# EAGLE design relay-board-adapter (EAGLE 9.2.2)
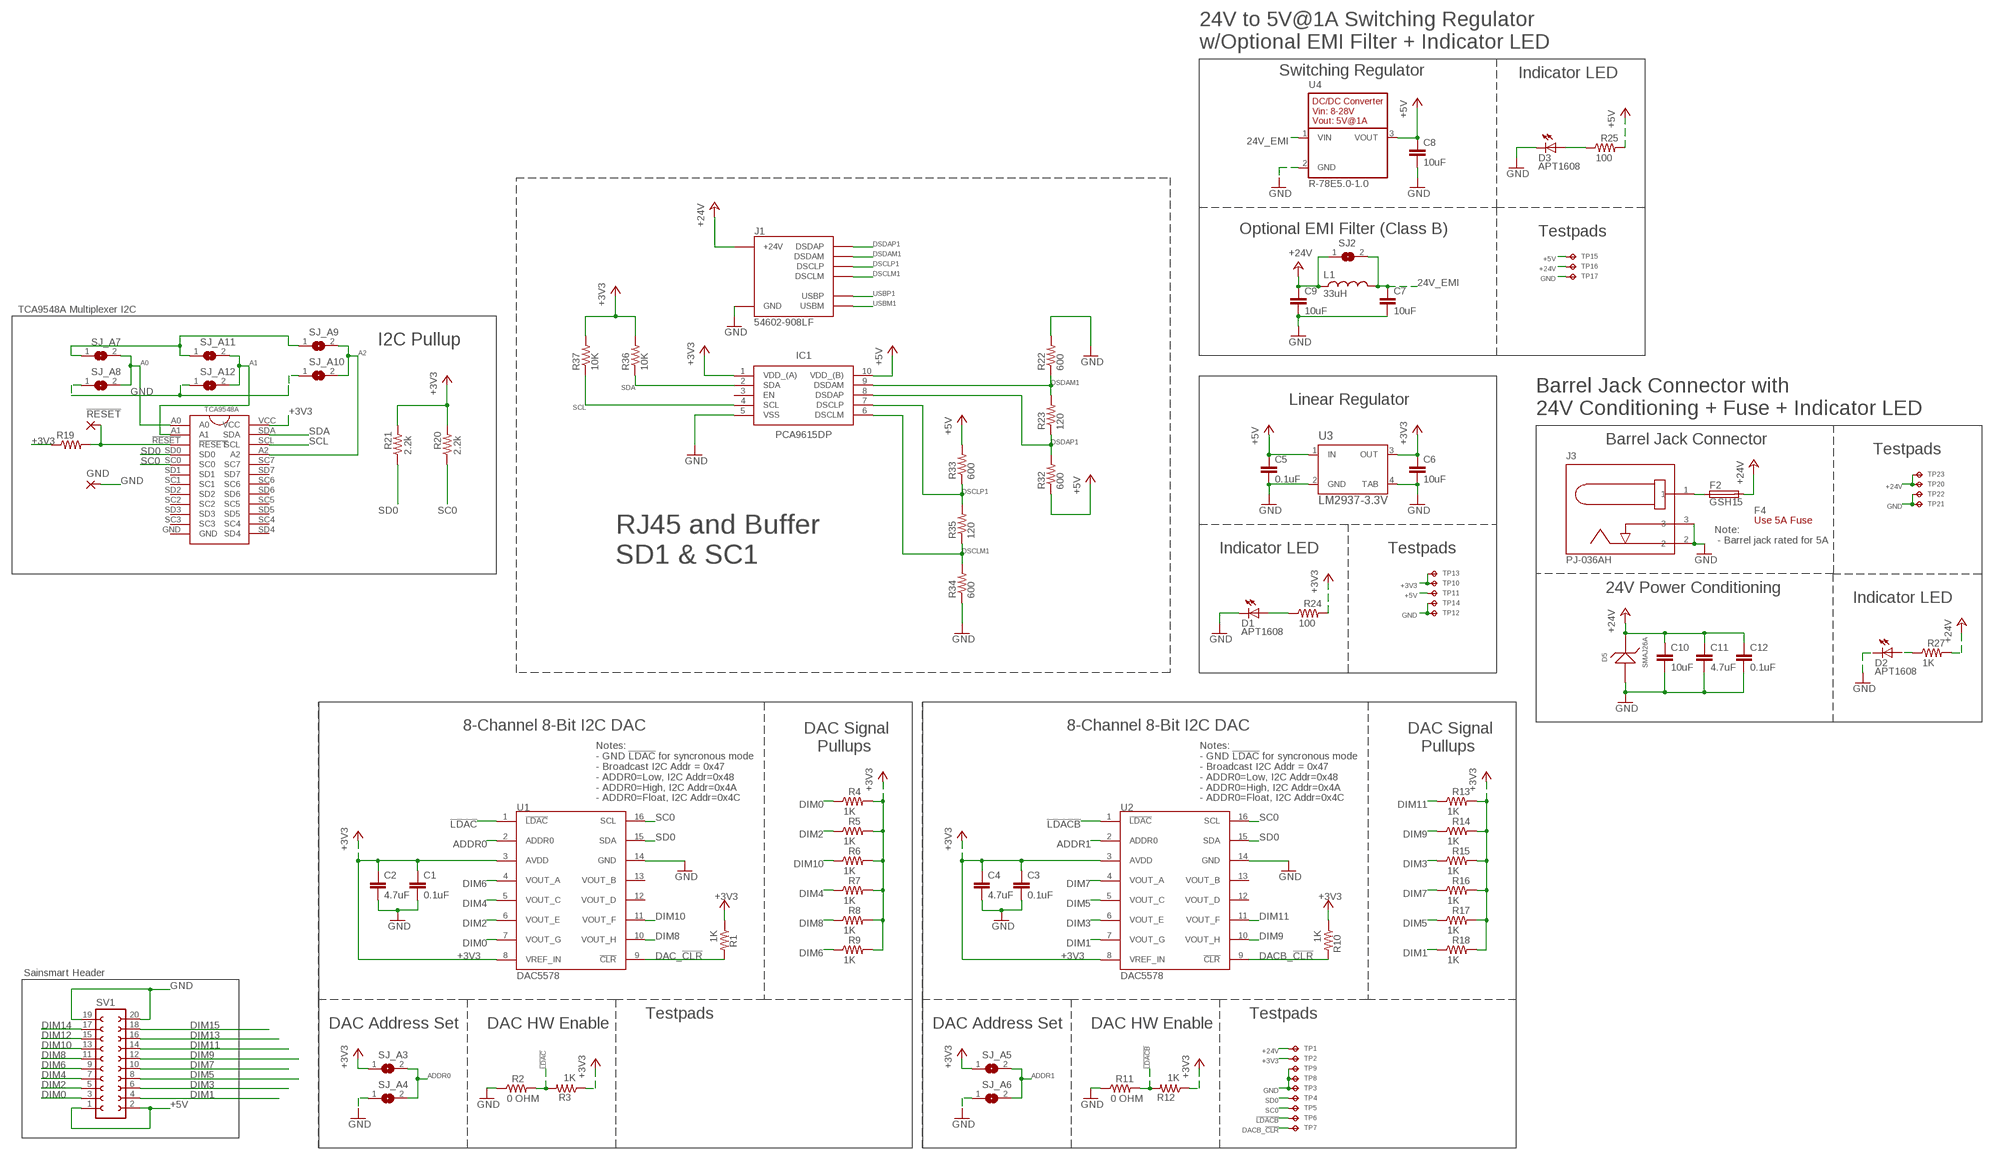
[diagram p0: schematic, sheet 1]

## Parts
!RESET!  1,6/0,8  [1,6/0,8]
C1  0.1uF  0.1UF-C0603C104K5RACTU  [C0603]
C2  4.7uF  4.7UF-CL21A475KBQNNNE  [C0805]
C3  0.1uF  0.1UF-C0603C104K5RACTU  [C0603]
C4  4.7uF  4.7UF-CL21A475KBQNNNE  [C0805]
C5  0.1uF  0.1UF-C0603C104K5RACTU  [C0603]
C6  10uF  10UF-GMK212BBJ106KG-T  [C0805]
C7  10uF  10UF-GMK212BBJ106KG-T  [C0805]
C8  10uF  10UF-GMK212BBJ106KG-T  [C0805]
C9  10uF  10UF-GMK212BBJ106KG-T  [C0805]
C10  10uF  10UF-GMK212BBJ106KG-T  [C0805]
C11  4.7uF  4.7UF-CL21A475KBQNNNE  [C0805]
C12  0.1uF  0.1UF-C0603C104K5RACTU  [C0603]
D1  APT1608  APT1608CGCK  [CHIPLED_0603]
D2  APT1608  APT1608CGCK  [CHIPLED_0603]
D3  APT1608  APT1608CGCK  [CHIPLED_0603]
D5  SMAJ26A  SMAJ26A-13-F  [SMA]
F2  GSH15  [GSH15]
F4  Use 5A Fuse  0217005.MXP  [FUSE-CARTRIDGE]
GND  1,6/0,8  [1,6/0,8]
IC1  PCA9615DP  [SOP50P490X110-10N]
J1  54602-908LF  OPENAG-V1-RJ45PTH  [OPENAG-V1-RJ45]
J3  PJ-036AH  BARREL-JACK-PJ-036AH-SMT-TR  [BARREL-JACK-PJ-036AH]
L1  33uH  33UH-29333C  [29333C]
R1  1K  1K-ERJ-PB3D1001V  [RC0603N]
R2  0 OHM  0OHM-RC0603JR-070RL  [RC0603N]
R3  1K  1K-ERJ-PB3D1001V  [RC0603N]
R4  1K  1K-ERJ-PB3D1001V  [RC0603N]
R5  1K  1K-ERJ-PB3D1001V  [RC0603N]
R6  1K  1K-ERJ-PB3D1001V  [RC0603N]
R7  1K  1K-ERJ-PB3D1001V  [RC0603N]
R8  1K  1K-ERJ-PB3D1001V  [RC0603N]
R9  1K  1K-ERJ-PB3D1001V  [RC0603N]
R10  1K  1K-ERJ-PB3D1001V  [RC0603N]
R11  0 OHM  0OHM-RC0603JR-070RL  [RC0603N]
R12  1K  1K-ERJ-PB3D1001V  [RC0603N]
R13  1K  1K-ERJ-PB3D1001V  [RC0603N]
R14  1K  1K-ERJ-PB3D1001V  [RC0603N]
R15  1K  1K-ERJ-PB3D1001V  [RC0603N]
R16  1K  1K-ERJ-PB3D1001V  [RC0603N]
R17  1K  1K-ERJ-PB3D1001V  [RC0603N]
R18  1K  1K-ERJ-PB3D1001V  [RC0603N]
R19  R-US_R0603  [R0603]
R20  2.2k  2.2K-RC0603JR-072K2L  [RC0603N]
R21  2.2k  2.2K-RC0603JR-072K2L  [RC0603N]
R22  600  R-US_R0603  [R0603]
R23  120  R-US_R0603  [R0603]
R24  100  100OHM-RC0603JR-07100RL  [RC0603N]
R25  100  100OHM-RC0603JR-07100RL  [RC0603N]
R27  1K  1K-ERJ-PB3D1001V  [RC0603N]
R32  600  R-US_R0603  [R0603]
R33  600  R-US_R0603  [R0603]
R34  600  R-US_R0603  [R0603]
R35  120  R-US_R0603  [R0603]
R36  10K  R-US_R0603  [R0603]
R37  10K  R-US_R0603  [R0603]
SJ2  EMI-BYPASS  [EMI-BYPASS]
SJ_A3  SOLDERJUMPERREFLOW_NOPASTE  [SJ1]
SJ_A4  SOLDERJUMPERREFLOW_NOPASTE  [SJ1]
SJ_A5  SOLDERJUMPERREFLOW_NOPASTE  [SJ1]
SJ_A6  SOLDERJUMPERREFLOW_NOPASTE  [SJ1]
SJ_A7  SOLDERJUMPERREFLOW_NOPASTE  [SJ1]
SJ_A8  SOLDERJUMPERREFLOW_NOPASTE  [SJ1]
SJ_A9  SOLDERJUMPERREFLOW_NOPASTE  [SJ1]
SJ_A10  SOLDERJUMPERREFLOW_NOPASTE  [SJ1]
SJ_A11  SOLDERJUMPERREFLOW_NOPASTE  [SJ1]
SJ_A12  SOLDERJUMPERREFLOW_NOPASTE  [SJ1]
SV1  FE10-2  [FE10-2]
TP1  TPTP04R  [TP04R]
TP2  TPTP04R  [TP04R]
TP3  TPTP04R  [TP04R]
TP4  TPTP04R  [TP04R]
TP5  TPTP04R  [TP04R]
TP6  TPTP04R  [TP04R]
TP7  TPTP04R  [TP04R]
TP8  TPTP04R  [TP04R]
TP9  TPTP04R  [TP04R]
TP10  TPTP04R  [TP04R]
TP11  TPTP04R  [TP04R]
TP12  TPTP04R  [TP04R]
TP13  TPTP04R  [TP04R]
TP14  TPTP04R  [TP04R]
TP15  TPTP06R  [TP06R]
TP16  TPTP06R  [TP06R]
TP17  TPTP06R  [TP06R]
TP20  TPTP04R  [TP04R]
TP21  TPTP04R  [TP04R]
TP22  TPTP04R  [TP04R]
TP23  TPTP04R  [TP04R]
U1  DAC5578  DAC5578SPW  [TSSOP16]
U2  DAC5578  DAC5578SPW  [TSSOP16]
U3  LM2937-3.3V  LM2937IMP-3.3/NOPB  [MP04A]
U4  R-78E5.0-1.0  [R-78E5.0-1.0]
U$1  TCA9548A  [TSSOP24]

## Nets
24V_EMI: C7.1 L1.2 SJ2.2 U4.1(VIN)
24V_IN1: F2.1 J3.1
!LDAC!: R2.2 R3.2 U1.1(!LDAC!)
!LDACB!: R11.2 R12.2 TP6.1(TP) U2.1(!LDAC!)
!RESET!: !RESET!.1(P) R19.2 U$1.!RESET!
+3V3: C1.1 C2.1 C3.1 C4.1 C6.1 IC1.1(VDD_(A)) R1.1 R3.1 R4.2 R5.2 R6.2 R7.2 R8.2 R9.2 R10.1 R12.1 R13.2 R14.2 R15.2 R16.2 R17.2 R18.2 R19.1 R20.2 R21.2 R24.2 R36.2 R37.2 SJ_A3.1 SJ_A5.1 SJ_A7.1 SJ_A9.1 SJ_A11.1 TP2.1(TP) TP10.1(TP) TP13.1(TP) U1.3(AVDD) U1.8(VREF_IN) U2.3(AVDD) U2.8(VREF_IN) U3.3(OUT) U$1.VCC
+5V: C5.1 C8.1 IC1.10(VDD_(B)) R25.2 R32.1 R33.2 SV1.1 SV1.2 TP11.1(TP) TP15.TP U3.1(IN) U4.3(VOUT)
+24V: C9.1 C10.1 C11.1 C12.1 D5.1 F2.2 J1.24V(6)(+24V) L1.1 R27.2 SJ2.1 TP1.1(TP) TP16.TP TP20.1(TP) TP23.1(TP)
A0: SJ_A7.2 SJ_A8.2 U$1.A0
A1: SJ_A11.2 SJ_A12.2 U$1.A1
A2: SJ_A9.2 SJ_A10.2 U$1.A2
ADDR0: SJ_A3.2 SJ_A4.2 U1.2(ADDR0)
ADDR1: SJ_A5.2 SJ_A6.2 U2.2(ADDR0)
DAC_!CLR!: R1.2 U1.9(!CLR!)
DACB_!CLR!: R10.2 TP7.1(TP) U2.9(!CLR!)
DIM0: R4.1 SV1.3 U1.7(VOUT_G)
DIM1: R18.1 SV1.4 U2.7(VOUT_G)
DIM2: R5.1 SV1.5 U1.6(VOUT_E)
DIM3: R15.1 SV1.6 U2.6(VOUT_E)
DIM4: R7.1 SV1.7 U1.5(VOUT_C)
DIM5: R17.1 SV1.8 U2.5(VOUT_C)
DIM6: R9.1 SV1.9 U1.4(VOUT_A)
DIM7: R16.1 SV1.10 U2.4(VOUT_A)
DIM8: R8.1 SV1.11 U1.10(VOUT_H)
DIM9: R14.1 SV1.12 U2.10(VOUT_H)
DIM10: R6.1 SV1.13 U1.11(VOUT_F)
DIM11: R13.1 SV1.14 U2.11(VOUT_F)
DIM12: SV1.15
DIM13: SV1.16
DIM14: SV1.17
DIM15: SV1.18
DSCLM1: IC1.6(DSCLM) J1.DSCLM(5)(DSCLM) R34.2 R35.1
DSCLP1: IC1.7(DSCLP) J1.DSCLP(4)(DSCLP) R33.1 R35.2
DSDAM1: IC1.9(DSDAM) J1.DSDAM(2)(DSDAM) R22.1 R23.2
DSDAP1: IC1.8(DSDAP) J1.DSDAP(1)(DSDAP) R23.1 R32.2
GND: C1.2 C2.2 C3.2 C4.2 C5.2 C6.2 C7.2 C8.2 C9.2 C10.2 C11.2 C12.2 D1.C D2.C D3.C D5.2 GND.1(P) IC1.5(VSS) J1.GND(3)(GND) J3.2 J3.3 R2.1 R11.1 R22.2 R34.1 SJ_A4.1 SJ_A6.1 SJ_A8.1 SJ_A10.1 SJ_A12.1 SV1.19 SV1.20 TP3.1(TP) TP8.1(TP) TP9.1(TP) TP12.1(TP) TP14.1(TP) TP17.TP TP21.1(TP) TP22.1(TP) U1.14(GND) U2.14(GND) U3.2(GND) U3.4(TAB) U4.2(GND)
N$1: D1.A R24.1
N$2: D2.A R27.1
N$3: D3.A R25.1
SC0: R20.1 TP5.1(TP) U1.16(SCL) U2.16(SCL) U$1.SC0
SCL: IC1.4(SCL) R37.1 U$1.SCL
SD0: R21.1 TP4.1(TP) U1.15(SDA) U2.15(SDA) U$1.SD0
SDA: IC1.2(SDA) R36.1 U$1.SDA
USBM1: J1.USBM(8)(USBM)
USBP1: J1.USBP(7)(USBP)
Unconnected: IC1.3(EN) U1.12(VOUT_D) U1.13(VOUT_B) U2.12(VOUT_D) U2.13(VOUT_B) U$1.SC1 U$1.SC2 U$1.SC3 U$1.SC4 U$1.SC5 U$1.SC6 U$1.SC7 U$1.SD1 U$1.SD2 U$1.SD3 U$1.SD4 U$1.SD5 U$1.SD6 U$1.SD7

## Notes on the sheet
- 24V to 5V@1A Switching Regulator
  w/Optional EMI Filter + Indicator LED
- Switching Regulator | Indicator LED
- Optional EMI Filter (Class B) | Testpads
- TCA9548A Multiplexer I2C
- I2C Pullup
- Linear Regulator
- Barrel Jack Connector with
  24V Conditioning + Fuse + Indicator LED
- Barrel Jack Connector
- Testpads
- Note:
   - Barrel jack rated for 5A
- Indicator LED | Testpads
- RJ45 and Buffer
  SD1 & SC1
- 24V Power Conditioning
- Indicator LED
- 8-Channel 8-Bit I2C DAC | 8-Channel 8-Bit I2C DAC
- DAC Signal 
     Pullups
- DAC Signal 
     Pullups
- Notes:
  - GND !LDAC! for syncronous mode
  - Broadcast I2C Addr = 0x47
  - ADDR0=Low, I2C Addr=0x48
  - ADDR0=High, I2C Addr=0x4A
  - ADDR0=Float, I2C Addr=0x4C
- Notes:
  - GND !LDAC! for syncronous mode
  - Broadcast I2C Addr = 0x47
  - ADDR0=Low, I2C Addr=0x48
  - ADDR0=High, I2C Addr=0x4A
  - ADDR0=Float, I2C Addr=0x4C
- Sainsmart Header
- Testpads | Testpads
- DAC Address Set | DAC HW Enable | DAC Address Set | DAC HW Enable

## Power pins joined to a net without a drawn wire
GND: U$1.GND

## Library data of the parts
!RESET! GND = wirepad:1,6/0,8: THROUGH-HOLE PAD
C1 C3 C5 C12 = openag-capacitors:0.1UF-C0603C104K5RACTU: CAP CER 0.1UF 50V X7R 0603 Description: 0.1µF ±10% 50V Ceramic Capacitor X7R 0603 (1608 Metric) Technical Specifications: Capacitance: 0.1µF Tolerance: ±10% Rated Voltage: 50V Temperature Coefficient: X7R Operating Temperature: -55°C ~ 125°C Package / Case: 0603 (1608 Metric) Datasheet(s): X7R Dielectric, 6.3-250 VDC Vendor(s): Digikey: 399-5089-1-ND; MANUFACTURER: Kemet; MPN: C0603C104K5RACTU; VENDOR: Digikey; VLINK: https://www.digikey.com/product-detail/en/kemet/C0603C104K5RACTU/399-5089-1-ND/1465623; VPN: 399-5089-1-ND
C2 C4 C11 = openag-capacitors:4.7UF-CL21A475KBQNNNE: CAP CER 4.7UF 50V X5R 0805 Description: 4.7µF ±10% 50V Ceramic Capacitor X5R 0805 (2012 Metric) Technical Specifications: Capacitance: 4.7uF Tolerance: ±10% Rated Voltage: 50V Temperature Coefficient: X5R Operating Temperature: -55°C ~ 85°C Package/Case: 0805 (2012 Metric) Datasheet(s): CL21A475KBQNNNE Characteristics Vendor(s): Digikey: 1276-1248-1-ND; MANUFACTURER: Samsung; MPN: CL21A475KBQNNNE; VENDOR: Digikey; VLINK: https://www.digikey.com/product-detail/en/samsung-electro-mechanics/CL21A475KBQNNNE/1276-1248-1-ND/3889334; VPN: 1276-1248-1-ND
C6-C10 = openag-capacitors:10UF-GMK212BBJ106KG-T: CAP CER 10UF 35V X5R 0805 Description: 10µF ±10% 35V Ceramic Capacitor X5R 0805 (2012 Metric) Technical Specifications: Capacitance: 10µF Tolerance: ±10% Rated Voltage: 35V Temperature Coefficient: X5R Operating Temperature: -55°C ~ 85°C Package / Case: 0805 (2012 Metric) Datasheet(s): GMK212BBJ106KG-T Spec Vendor(s): Digikey: 587-4893-1-ND; MANUFACTURER: Taiyo Yuden; MPN: GMK212BBJ106KG-T; VENDOR: Digikey; VLINK: https://www.digikey.com/product-detail/en/taiyo-yuden/GMK212BBJ106KG-T/587-4893-1-ND/6563736; VPN: 587-4893-1-ND
D1-D3 = openag-diodes:APT1608CGCK: LED GREEN CLEAR 0603 SMD Description: Green 570nm LED Indication - Discrete 2.1V 0603 (1608 Metric) Technical Specifications: Color: Green Lens Color: Colorless Lens Transparency: Clear Millicandela Rating: 50mcd Lens Style/Size: Rectangle with Flat Top, 1.20mm x 0.80mm Voltage - Forward (Vf) (Typ): 2.1V Current - Test: 20mA Viewing Angle: 120° Mounting Type: Surface Mount Wavelength - Dominant: 570nm Wavelength - Peak: 574nm Package / Case: 0603 (1608 Metric) Supplier Device Package: Chip LED Size / Dimension: 1.60mm L x 0.80mm W Height (Max): 0.75mm Datasheet(s): APT1608CGCK Vendor(s): Digikey: 754-1116-1-ND; MANUFACTURER: Kingbright; MPN: APT1608CGCK; VENDOR: Digikey; VLINK: https://www.digikey.com/product-detail/en/kingbright/APT1608CGCK/754-1116-1-ND/1747833#; VPN: 754-1116-1-ND
D5 = openag-diodes:SMAJ26A-13-F: TVS DIODE 26VWM 42.1VC SMA Description: TVS DIODE 26VWM 42.1VC SMA Technical Specifications: Type: Zener Voltage - Reverse Standoff (Typ): 26V Voltage - Breakdown (Min): 28.9V Voltage - Clamping (Max) @ Ipp: 42.1V Current - Peak Pulse (10/1000µs): 9.5A Power - Peak Pulse: 400W Power Line Protection: No Operating Temperature: -55°C ~ 150°C (TJ) DO-214AC, SMA Datasheet(s): SMAJ5.0(C)A - SMAJ200(C)A Vendor(s): Digikey: SMAJ26A-FDICT-ND; MANUFACTURER: Diodes Incorporated; MPN: SMAJ26A-13-F; VENDOR: Digikey; VLINK: https://www.digikey.com/product-detail/en/diodes-incorporated/SMAJ26A-13-F/SMAJ26A-FDICT-ND/806583; VPN: SMAJ26A-FDICT-ND
F2 = openag-fuses:GSH15: FUSE BLOCK CART 250V 6.3A PCB Description: Fuse Block 6.3A 250V 1 Circuit Cartridge PCB Technical Specifications: Fuseholder Type: Block Fuse Type: Cartridge For Use With/Related Products: 5mm x 20mm Fuse Size: 5mm x 20mm Number of Circuits: 1 Voltage: 250V Current Rating: 6.3A Mounting Type: PCB Orientation: Horizontal Termination Style: PC Pin Contact Material: Copper Alloy Contact Finish: Tin Datasheet(s): 649 Series Vendor(s): Digikey: WK0011-ND; MANUFACTURER: Littelfuse Inc.; MPN: 64900001039; VENDOR: Digikey; VLINK: https://www.digikey.com/product-detail/en/littelfuse-inc/64900001039/WK0011-ND/245470; VPN: WK0011-ND
F4 = openag-fuses:0217005.MXP: FUSE GLASS 5A 250VAC 5X20MM Description: FUSE GLASS 5A 250VAC 5X20MM Technical Specifications: Fuse Type: Cartridge, Glass Current Rating: 5A Voltage Rating - AC: 250V Response Time: Fast Package / Case: 5mm x 20mm Mounting Type: Holder Breaking Capacity @ Rated Voltage: 50A Melting I²t: 42.795 Approvals: BSI, CE, CCC, CSA, KC, PSE, SEMKO, UR, VDE Operating Temperature: -55°C ~ 125°C Size / Dimension: 0.205" Dia x 0.787" L (5.20mm x 20.00mm) DC Cold Resistance: 0.0137 Ohms Datasheet(s): 217 Series Datasheet Vendor(s): Digikey: F1725-ND; MANUFACTURER: Littelfuse Inc.; MPN: 0217005.MXP; VENDOR: Digikey; VLINK: https://www.digikey.com/product-detail/en/littelfuse-inc/0217005.MXP/F1725-ND/777549; VPN: F1725-ND
IC1 = PCA9615DP:PCA9615DP: Buffer, ReDriver 2 Channel 400kHz 10-TSSOP Source: Datasheet; DESCRIPTION: Buffer, ReDriver 2 Channel 400kHz 10-TSSOP; HEIGHT: 1.1mm; MANUFACTURER_NAME: Nexperia; MANUFACTURER_PART_NUMBER: PCA9615DP; SUPPLIER_NAME: RS
J1 = openag_connector:OPENAG-V1-RJ45: Amphenol FCI - 54602-908LF - CONN MOD JACK 8P8C R/A UNSHLD Description: Jack Modular Connector 8p8c (RJ45, Ethernet) 90� Angle (Right) Unshielded Cat3 Technical Specifications: Connector Type: Jack Number of Positions/Contacts: 8p8c (RJ45, Ethernet) Number of Ports: 1 Number of Rows: 1 Mounting Type: Through Hole Orientation: 90� Angle (Right) Termination: Solder Shielding: Unshielded Ratings: Cat3 Features: Board Lock LED Color: Does Not Contain LED Tab Direction: Down Contact Material: Copper Alloy Contact Finish: Gold Contact Finish Thickness: 15�in (0.38�m) Housing Material: Polyester, Glass Filled Operating Temperature: -40�C ~ 70�C Datasheet(s): 54601-x04(zzz)WPLF Drawing Vendor(s): Digikey: 609-1046-ND; POPULATE: YES; VERIFIED: NO
J3 = openag-connectors:BARREL-JACK-PJ-036AH-SMT-TR: CONN PWR JACK 2X5.5MM SOLDER Description: Power Barrel Connector Jack 2.10mm ID (0.083"), 5.50mm OD (0.217") Surface Mount, Right Angle Technical Specifications: Connector Type: Jack Gender: Male Industry Recognized Mating Diameter: 2.10mm ID (0.083"), 5.50mm OD (0.217") Actual Diameter: 0.078" (2.00mm ID), 0.248" (6.30mm OD) Number of Positions/Contacts: 2 Conductors, 3 Contacts Internal Switch(s): Single Switch, Normally Closed Mounting Type: Surface Mount, Right Angle Termination: Solder Shielding: Unshielded Voltage - Rated: 24VDC Current Rating: 5A Mating Length/Depth: 0.360" (9.15mm) Contact Material - Plating: Silver Operating Temperature: -25°C ~ 85°C Housing Material: Polyamide (PA6T), Nylon 6T Contact Material: Brass; Copper Alloy Body Color: Black Datasheet(s): PJ-036AH-SMT-TR Vendor(s): Digikey: CP-036AHPJCT-ND; MANUFACTURER: CUI Inc.; MPN: PJ-036AH-SMT-TR; VENDOR: Digikey; VLINK: https://www.digikey.com/product-detail/en/cui-inc/PJ-036AH-SMT-TR/CP-036AHPJCT-ND/1530994; VPN: CP-036AHPJCT-ND
L1 = openag-inductors:33UH-29333C: FIXED IND 33UH 1A 120 MOHM SMD Description: 33µH Shielded Wirewound Inductor 1A 120 mOhm Max Nonstandard Technical Specifications: Type: Wirewound Inductance: 33µH Current Rating: 1A Shielding: Shielded DC Resistance (DCR): 120 mOhm Max Operating Temperature: -40°C ~ 85°C Frequency - Test: 10kHz Mounting Type: Surface Mount Package / Case: Nonstandard Size / Dimension: 0.283" L x 0.283" W (7.20mm x 7.20mm) Height - Seated (Max): 0.157" (4.00mm) Datasheet(s): 2900 Series Vendor(s): Digikey: 811-1138-1-ND; MANUFACTURER: Murata Power Solutions Inc.; MPN: 29333C; VENDOR: Digikey; VLINK: https://www.digikey.com/product-detail/en/murata-power-solutions-inc/29333C/811-1138-1-ND/1924860; VPN: 811-1138-1-ND
R1 R3-R10 R12-R18 R27 = openag-resistors:1K-ERJ-PB3D1001V: RES SMD 1K OHM 0.5% 1/5W 0603 Description: 1 kOhms ±0.5% 0.2W, 1/5W Chip Resistor 0603 (1608 Metric) Automotive AEC-Q200, Pulse Withstanding Thick Film Technical Specifications: Resistance: 1 kOhms Tolerance: ±0.5% Power: 0.2W, 1/5W Operating Temperature: -55°C ~ 155°C Package / Case: 0603 (1608 Metric) Datasheet(s): ERJ-PB3, PB6 Series, High Precision Datasheet Vendor(s): Digikey: P20283CT-ND; MANUFACTURER: Panasonic; MPN: P20283CT-ND; VENDOR: Digikey; VLINK: https://www.digikey.com/product-detail/en/panasonic-electronic-components/ERJ-PB3D1001V/P20283CT-ND/6214538; VPN: P20283CT-ND
R2 R11 = openag-resistors:0OHM-RC0603JR-070RL: RES SMD 0 OHM JUMPER 1/10W 0603 Description: 0 Ohms Jumper 0.1W, 1/10W Chip Resistor 0603 (1608 Metric) Moisture Resistant Thick Film Technical Specifications: Resistance: 0 Ohms Power: 0.1W, 1/10W Operating Temperature: -55°C ~ 155°C Package / Case: 0603 (1608 Metric) Datasheet(s): RC Series, L Datasheet Vendor(s): Digikey: 311-0.0GRCT-ND; MANUFACTURER: Yageo; MPN: RC0603JR-070RL; VENDOR: Digikey; VLINK: https://www.digikey.com/product-detail/en/yageo/RC0603JR-070RL/311-0.0GRCT-ND/729622; VPN: 311-0.0GRCT-ND
R19 R22 R23 R32-R37 = rcl:R-US_: RESISTOR, American symbol
R20 R21 = openag-resistors:2.2K-RC0603JR-072K2L: RES SMD 2.2K OHM 5% 1/10W 0603 Description: 2.2 kOhms ±5% 0.1W, 1/10W Chip Resistor 0603 (1608 Metric) Moisture Resistant Thick Film Technical Specifications: Resistance: 2.2 kOhms Tolerance: ±5% Power (Watts): 0.1W, 1/10W Composition: Thick Film Features: Moisture Resistant Temperature Coefficient: ±100ppm/°C Operating Temperature: -55°C ~ 155°C Package / Case: 0603 (1608 Metric) Supplier Device Package: 0603 Size / Dimension: 0.063" L x 0.032" W (1.60mm x 0.80mm) Height - Seated (Max): 0.022" (0.55mm) Number of Terminations: 2 Datasheet(s): RC Series, L Datasheet Chip Resistor Marking Vendor(s): Digikey: 311-2.2KGRCT-ND; MANUFACTURER: Yageo; MPN: RC0603JR-072K2L; VENDOR: Digikey; VLINK: https://www.digikey.com/product-detail/en/yageo/RC0603JR-072K2L/311-2.2KGRCT-ND/729676#; VPN: 311-2.2KGRCT-ND
R24 R25 = openag-resistors:100OHM-RC0603JR-07100RL: RES SMD 100 OHM 5% 1/10W 0603 Description: 100 Ohms ±5% 0.1W, 1/10W Chip Resistor 0603 (1608 Metric) Moisture Resistant Thick Film Technical Specifications: Resistance: 100 Ohms Tolerance: ±5% Power (Watts): 0.1W, 1/10W Composition: Thick Film Features: Moisture Resistant Temperature Coefficient: ±100ppm/°C Operating Temperature: -55°C ~ 155°C Package / Case: 0603 (1608 Metric) Supplier Device Package: 0603 Size / Dimension: 0.063" L x 0.032" W (1.60mm x 0.80mm) Height - Seated (Max): 0.022" (0.55mm) Number of Terminations: 2 Datasheet(s): Thick Film Chip Resistor Intro Chip Resistor Marking RC Series, L Datasheet Vendor(s): Digikey: 311-100GRCT-ND; MANUFACTURER: Yageo; MPN: RC0603JR-07100RL; VENDOR: Digikey; VLINK: https://www.digikey.com/product-detail/en/yageo/RC0603JR-07100RL/311-100GRCT-ND/729644; VPN: 311-100GRCT-ND
SJ2 = openag-connectors:EMI-BYPASS: EMI Bypass Solder Jumper; MPN: N/A
SJ_A3-SJ_A12 = openag-connectors:SOLDERJUMPER: SMD Solder JUMPER Solder the two pads together to create a connection, or remove the solder to break it. REFLOW - Use this footprint for solder paste and reflow ovens. WAVE - Use this footprint for hand-soldering (larger pads). CLOSED - Has a trace between the two pads to ensure it is closed by default. The trace needs to be cut to disable the jumper, and can be closed again by creating a solder bridge between the two pads.; MPN: N/A
SV1 = con-lsta:FE10-2: FEMALE HEADER; OC_FARNELL: unknown; OC_NEWARK: unknown
TP1-TP17 TP20-TP23 = openag-testpads:TP: Test pad; MPN: N/A
U1 U2 = openag-dacs:DAC5578SPW: IC DAC 8BIT I2C OCTAL 16TSSOP Description: 8 Bit Digital to Analog Converter 8 16-TSSOP Technical Specifications: Number of Bits: 8 Number of D/A Converters: 8 Settling Time: 12µs (Typ) Output Type: Voltage - Buffered Differential Output: No Data Interface: I²C Reference Type: External Voltage - Supply, Analog: 2.7 V ~ 5.5 V Voltage - Supply, Digital: 2.7 V ~ 5.5 V INL/DNL (LSB): ±0.01, ±0.01 Architecture: String DAC Operating Temperature: -40°C ~ 125°C Package / Case: 16-TSSOP (0.173", 4.40mm Width) Supplier Device Package: 16-TSSOP Base Part Number: DAC5578 Datasheet(s): DAC5578,6578,7578 Analog Signal Chain Guide Vendor(s): Digikey: 296-27736-5-ND; MANUFACTURER: Texas Instruments; MPN: DAC5578SPW; VENDOR: Digikey; VLINK: https://www.digikey.com/product-detail/en/texas-instruments/DAC5578SPW/296-27736-5-ND/2360827; VPN: 296-27736-5-ND
U3 = openag-regulators:LM2937IMP-3.3/NOPB: IC REG LIN 3.3V 400MA SOT223-4 Description: Linear Voltage Regulator IC Positive Fixed 1 Output 3.3V 400mA SOT-223-4 Technical Specifications: Output Configuration: Positive Output Type: Fixed Number of Regulators: 1 Voltage - Input (Max): 26V Voltage - Output (Min/Fixed): 3.3V Voltage Dropout (Max): 1V @ 50mA Current - Output: 400mA Current - Quiescent (Iq): 2mA Current - Supply (Max): 1.25A Protection Features: Over Temperature, Reverse Polarity, Short Circuit Operating Temperature: -40°C ~ 85°C Mounting Type: Surface Mount Package / Case: TO-261-4, TO-261AA Supplier Device Package: SOT-223-4 Base Part Number: LM2937 Datasheet(s): LM2937-2.5, LM2937-3.3 Datasheet Vendor(s): Digikey: LM2937IMP-3.3/NOPBCT-ND; MANUFACTURER: Texas Instruments; MPN: LM2937IMP-3.3/NOPB; VENDOR: Digikey; VLINK: https://www.digikey.com/product-detail/en/texas-instruments/LM2937IMP-3.3-NOPB/LM2937IMP-3.3-NOPBCT-ND/270742#; VPN: LM2937IMP-3.3/NOPBCT-ND
U4 = openag-regulators:R-78E5.0-1.0: DC/DC CONVERTER 5V 5W Description: Linear Regulator Replacement DC DC Converter 1 Output 5V 1A 8V - 28V Input Technical Specifications: Type: Linear Regulator Replacement Number of Outputs: 1 Voltage - Input (Min): 8V Voltage - Input (Max): 28V Voltage - Output 1: 5V Current - Output (Max): 1A Power (Watts): 5W Applications: ITE (Commercial) Features: SCP Operating Temperature: -40°C ~ 85°C Efficiency: 91% Mounting Type: Through Hole Package / Case: 3-SIP Module Size / Dimension: 0.46" L x 0.33" W x 0.41" H (11.6mm x 8.5mm x 10.4mm) Datasheet(s): R-78E-1.0 Series Datasheet Vendor(s): Digikey: 945-2201-ND; MANUFACTURER: Recom Power; MPN: R-78E5.0-1.0; VENDOR: Digikey; VLINK: https://www.digikey.com/product-detail/en/recom-power/R-78E5.0-1.0/945-2201-ND/4930585; VPN: 945-2201-ND
U$1 = TCA9548A:TCA9548A

## Net classes
0 default: width 0.305 mm, drill 0.254 mm, clearance 0.254 mm

## Board
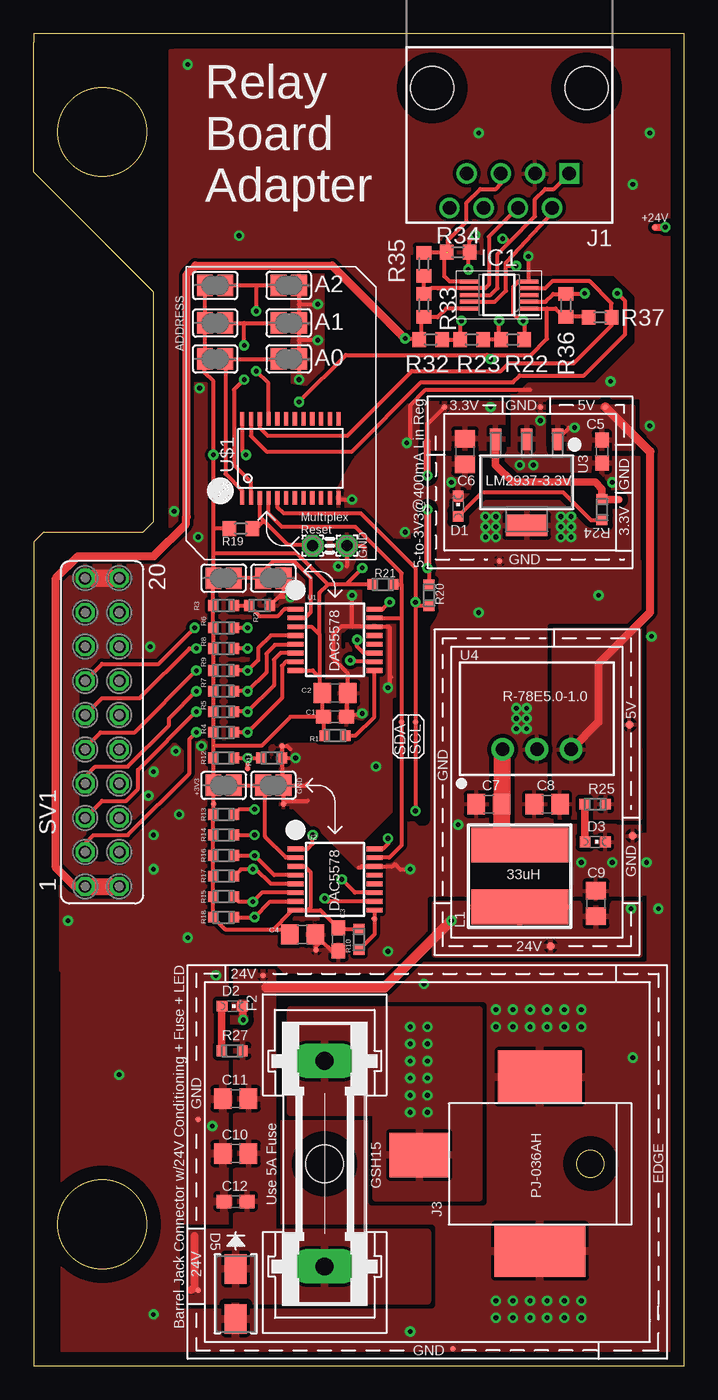
[diagram p1: board, top side]
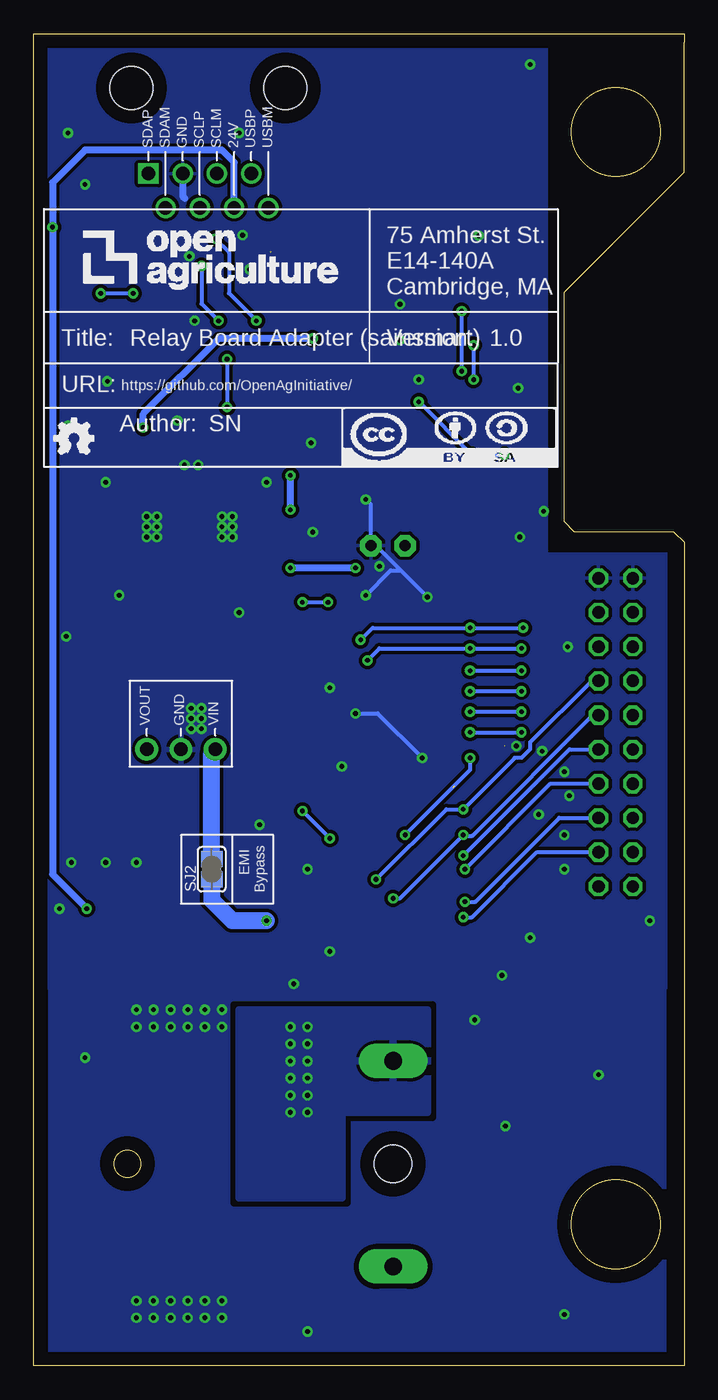
[diagram p2: board, bottom side, seen from below]

Size 48.26 x 98.81 mm. Coordinates in mm from the lower left corner, seen from the top.
Outline: 0,0 48.26,0 48.26,98.81 0,98.81 0,98.17 0,88.52 8.89,79.63 8.89,62.61 8.13,61.85 0.76,61.85 0,61.09 0,0
Outline: circle at 5.08,10.49 radius 3.3
Outline: circle at 5.08,91.52 radius 3.3
Copper layers (1*16): Top 0.035mm / dielectric 1.5mm / Bottom 0.035mm
Design rules "default": minimum track width 6mil, minimum drill 0.35mm, track to track 6mil, track to pad 6mil, pad to pad 6mil, via to via 6mil, smd to smd 6mil, copper to edge 40mil, drill to drill 6mil, minimum pad ring 10mil, minimum via ring 8mil, stop-mask expansion 4mil, vias tented up to drill 0mil, thermal gap 10mil
tRestrict: 54 lines
bRestrict: 1 lines

### Footprints (pad centres in the part's own frame; a part is rotated, then mirrored left to right if it is on the bottom)
1,6/0,8 = drill 0.813 pad 1.6 octagon: 1 0,0
C0603 = smd 1.1 x 1: 1 -0.85,0; 2 0.85,0
C0805 = smd 1.3 x 1.5: 1 -0.95,0; 2 0.95,0
CHIPLED_0603 = smd 0.8 x 0.8: A 0,-0.75; C 0,0.75
SMA = smd 2.18 x 1.63: 1 -1.857,0; 2 1.857,0
GSH15 = drill 1.321 pad 2.54 long: 1 -7.62,0; 2 7.62,0 | hole 2.794: 0,0
SOP50P490X110-10N = smd 1.4 x 0.3: 1 -2.2,1; 2 -2.2,0.5; 3 -2.2,0; 4 -2.2,-0.5; 5 -2.2,-1; 6 2.2,-1; 7 2.2,-0.5; 8 2.2,0; 9 2.2,0.5; 10 2.2,1
OPENAG-V1-RJ45 = drill 1: 24V(6) 1.905,8.89; DSCLM(5) 0.635,6.35; DSCLP(4) -0.635,8.89; DSDAM(2) -3.175,8.89; GND(3) -1.905,6.35; USBM(8) 4.445,8.89; USBP(7) 3.175,6.35 | drill 1 square: DSDAP(1) -4.445,6.35 | hole 3.2: -5.715,0; 5.715,0
BARREL-JACK-PJ-036AH = smd 4.4 x 3.3: 1 2.2,-0.65 | smd 6.75 x 3.9: 2 -6.75,6.45 | smd 6.2 x 3.9: 3 -6.75,-6.45
29333C = smd 2.6 x 7.2: 1 -2.3,0; 2 2.3,0
RC0603N = smd 0.756 x 0.8: 1 -0.778,0; 2 0.778,0
R0603 = smd 1 x 1.1: 1 -0.85,0; 2 0.85,0
EMI-BYPASS = smd 1.168 x 1.6: 1 -0.762,0.254; 2 0.762,0.254
SJ1 = smd 1.168 x 1.6: 1 -0.762,0; 2 0.762,0
FE10-2 = drill 0.914 octagon: 1 -11.43,1.27; 2 -11.43,-1.27; 3 -8.89,1.27; 4 -8.89,-1.27; 5 -6.35,1.27; 6 -6.35,-1.27; 7 -3.81,1.27; 8 -3.81,-1.27; 9 -1.27,1.27; 10 -1.27,-1.27; 11 1.27,1.27; 12 1.27,-1.27; 13 3.81,1.27; 14 3.81,-1.27; 15 6.35,1.27; 16 6.35,-1.27; 17 8.89,1.27; 18 8.89,-1.27; 19 11.43,1.27; 20 11.43,-1.27
TP04R = smd 0.4 x 0.4: 1 0,0
TP06R = smd 0.6 x 0.6: TP 0,0
TSSOP16 = smd 0.35 x 1.2: 1 -2.275,-2.925; 2 -1.625,-2.925; 3 -0.975,-2.925; 4 -0.325,-2.925; 5 0.325,-2.925; 6 0.975,-2.925; 7 1.625,-2.925; 8 2.275,-2.925; 9 2.275,2.925; 10 1.625,2.925; 11 0.975,2.925; 12 0.325,2.925; 13 -0.325,2.925; 14 -0.975,2.925; 15 -1.625,2.925; 16 -2.275,2.925
MP04A = smd 1.6 x 0.838: 1 -3.2,2.3; 2 -3.2,0; 3 -3.2,-2.3 | smd 1.6 x 3.099: 4 3.2,0
R-78E5.0-1.0 = drill 1 pad 1.676: 1 -2.54,0; 2 0,0; 3 2.54,0
TSSOP24 = smd 0.305 x 0.991: !RESET! -2.275,-2.918; A0 -3.575,-2.918; A1 -2.925,-2.918; A2 -1.625,2.918; GND 3.575,-2.918; SC0 -0.975,-2.918; SC1 0.325,-2.918; SC2 1.625,-2.918; SC3 2.925,-2.918; SC4 2.925,2.918; SC5 1.625,2.918; SC6 0.325,2.918; SC7 -0.975,2.918; SCL -2.275,2.918; SD0 -1.625,-2.918; SD1 -0.325,-2.918; SD2 0.975,-2.918; SD3 2.275,-2.918; SD4 3.575,2.918; SD5 2.275,2.918; SD6 0.975,2.918; SD7 -0.325,2.918; SDA -2.925,2.918; VCC -3.575,2.918

### Placement (x,y rotation side)
!RESET!  20.7,60.83 0 top
ATTRIBUTES  [DOCFIELD]  47.48,66.69 0 bottom
C1  22.35,48.13 0 top
C2  22.35,49.91 0 top
C3  22.61,31.62 270 top
C4  19.94,32 0 top
C5  42.16,67.82 270 top
C6  32,67.82 270 top
C7  33.78,41.66 180 top
C8  38.1,41.66 180 top
C9  41.72,34.29 90 top
C10  14.99,15.75 180 top
C11  14.99,19.81 180 top
C12  14.99,12.19 180 top
D1  31.5,63.75 0 top
D2  14.73,26.67 270 top
D3  41.66,38.86 270 top
D5  14.99,5.33 270 top
F2  21.59,14.99 270 top
F4  17.27,18.03 270 top
GND  23.24,60.83 0 top
IC1  34.53,79.42 180 top
J1  35.3,94.79 180 top
J3  30.81,14.99 180 top
L1  36.07,36.32 90 top
R1  22.35,46.74 0 top
R2  16.76,56.39 180 top
R3  14.1,56.39 0 top
R4  14.1,46.99 180 top
R5  14.1,48.51 180 top
R6  14.1,54.74 180 top
R7  14.1,50.04 180 top
R8  14.1,53.21 180 top
R9  14.1,51.56 180 top
R10  24.13,31.62 270 top
R11  17.65,45.08 180 top
R12  14.1,45.08 0 top
R13  14.1,40.89 180 top
R14  14.1,39.37 180 top
R15  14.1,34.8 180 top
R16  14.1,37.85 180 top
R17  14.1,36.32 180 top
R18  14.1,33.27 180 top
R19  15.37,62.1 0 top
R20  29.34,57.15 90 top
R21  25.91,57.96 180 top
R22  35.55,76.12 0 top
R23  32.5,76.12 0 top
R24  42.16,63.5 90 top
R25  41.66,41.66 0 top
R27  14.73,23.37 0 top
R32  29.45,76.12 0 top
R33  28.95,78.66 270 top
R34  31.49,82.59 180 top
R35  28.95,81.7 270 top
R36  39.49,78.66 270 top
R37  42.03,77.77 180 top
SJ2  34.8,36.83 90 bottom
SJ_A3  14.1,58.42 0 top
SJ_A4  17.78,58.42 180 top
SJ_A5  14.1,43.05 0 top
SJ_A6  17.78,43.05 180 top
SJ_A7  13.46,74.68 0 top
SJ_A8  18.92,74.68 180 top
SJ_A9  13.46,80.14 0 top
SJ_A10  18.92,80.14 180 top
SJ_A11  13.46,77.34 0 top
SJ_A12  18.92,77.34 180 top
SV1  5.08,46.99 90 top
TP1  46.1,84.45 180 top
TP2  13.34,41.66 180 top
TP3  18.41,45.97 0 top
TP4  27.3,47.75 180 top
TP5  28.32,47.75 180 top
TP6  15.88,44.32 180 top
TP7  25.27,33.15 180 top
TP8  18.54,41.66 90 top
TP9  20.95,30.86 270 top
TP10  43.43,64.26 180 top
TP11  42.42,71.12 180 top
TP12  34.54,59.69 180 top
TP13  30.48,71.12 180 top
TP14  37.59,71.12 180 top
TP15  44.2,47.56 0 top
TP16  38.35,31.11 0 top
TP17  44.45,39.31 0 top
TP20  12.19,5.59 270 top
TP21  12.19,18.29 270 top
TP22  31.12,1.27 270 top
TP23  17.02,28.96 270 top
U1  22.35,53.85 270 top
U2  22.35,36.07 270 top
U3  36.58,65.53 270 top
U4  37.34,45.72 0 top
U$1  19.05,67.31 0 top

### Tracks (layer width: path | path; a pad name or v marks a point on that pad's centre or on a via)
24V_EMI
  Top 1.27: U4.1 34.73,45.65 C7.1 34.73,39.96 arc90 L1.2
  Bottom 1.27: SJ2.2 35.05,45.47 U4.1
24V_IN1  (via drill 0.35)
  other vias: 29.21,18.8 27.94,18.8 29.21,20.07 27.94,20.07 29.21,21.34 27.94,21.34 29.21,22.61 29.21,23.88 27.94,23.88 27.94,22.61 27.94,25.15 29.21,25.15
  pour Bottom (isolate 0.406): 19.05,18.8 19.05,26.42 33.02,26.42 33.02,12.45 25.4,12.45 25.4,18.8
  pour Top (isolate 0.406): 19.05,26.42 19.05,18.8 25.4,18.8 25.4,12.45 33.02,12.45 33.02,26.42
!LDAC!
  Top 0.305: R3.2 R2.2 16.79,55.58 18.09,55.58 18.63,56.12 U1.1
!LDACB!  (via drill 0.35)
  Top 0.305: U2.1 20.31,38.34 20.7,38.73 v20.7,39.37 | R12.2 v15.88,45.08 | v15.88,45.08 R11.2 | TP6.1 v15.88,45.08
  Bottom 0.305: v20.7,39.37 15.88,44.2 v15.88,45.08
!RESET!
  Top 0.305: !RESET!.1 20.7,60.88 18.87,60.88 17.15,62.61 | U$1.!RESET! 16.77,62.98 17.15,62.61 | R19.2 16.51,62.1 17.02,62.61 17.15,62.61
+3V3  (via drill 0.35)  (1 unrouted)
  Top 0.305: 17.78,32.38 14.21,32.38 R18.2 R15.2 R17.2 R16.2 R14.2 R13.2 13.34,40.91 TP2.1 SJ_A5.1 13.32,43.07 R12.1 13.32,45.97 | 20.32,33.79 U2.8 19.05,33.79 19.05,33.65 17.78,32.38 | U2.3 20.13,37.04 20.43,36.74 20.43,36.72 20.57,36.58 20.57,34.05 20.32,33.79 | C2.1 21.27,50.04 | C1.1 19.05,48.13 16.94,46.02 13.32,46.02 R4.2 R5.2 R7.2 R9.2 R8.2 R6.2 R3.1 13.32,58.4 SJ_A3.1 13.34,60.32 | C2.1 21.4,48.23 C1.1 | C1.1 21.5,46.81 R1.1 | U1.8 20.69,51.57 21.21,51.05 | C2.1 21.34,49.98 21.34,50.16 21.21,50.29 21.21,51.05 | U1.3 20.62,54.82 21.21,54.23 | 21.21,54.23 21.21,51.05 | 20.32,33.79 20.31,33.79 21.27,33.79 22.6,32.46 | C3.1 22.6,32.46 | R10.1 22.66,32.4 22.6,32.46 | 17.78,32.38 18.61,32.38 C4.1 | SJ_A9.1 SJ_A11.1 SJ_A7.1 12.7,73.66 13.34,73.03 13.34,62.23 | 13.34,60.32 13.34,62.23 | R21.2 23.16,57.96 | 23.16,57.96 21.82,57.96 | 21.82,57.96 19.54,60.25 13.41,60.25 13.34,60.32 | 21.21,54.23 21.21,57.35 21.82,57.96 | v29.21,59.18 29.34,59.05 R20.2 | v15.75,67.56 15.48,67.84 U$1.VCC | R19.1 13.46,62.1 13.34,62.23 | IC1.1 38.09,78.42 | 38.09,78.42 38.71,78.42 39.32,77.81 R36.2 41.14,77.81 R37.2 | 38.09,78.42 38.09,76.18 36.88,74.97 33.66,74.97 | 33.66,74.97 23.16,74.97 v19.69,71.5 | v24.38,59.18 23.16,57.96 | 33.66,74.97 33.7,74.93 33.7,74.89 v33.91,74.68 | 29.21,68.58 29.21,69.85 TP13.1
  Top 0.508: v29.21,63.5 v29.21,59.18 | v29.21,66.04 29.21,68.58
  Top 0.559: TP10.1 42.18,64.26 R24.2 42.16,65.02 41.66,65.53 35.56,65.53 34.28,66.82 U3.3
  Bottom 0.305: v13.34,67.56 v15.75,67.56 v19.69,71.5 | v33.91,74.68 v33.91,71.12
  Bottom 0.508: v29.21,63.5 v29.21,66.04 | v24.38,59.18 v29.21,59.18
  pour Top (isolate 0.305): 29.21,71.37 29.21,68.07 34.8,68.07 34.8,71.37
+5V  (via drill 0.35)
  Top 0.305: IC1.10 30.61,78.42 29.96,77.77 28.98,77.77 | 28.98,77.77 R33.2 | 28.98,77.77 28.73,77.51 28.73,76.24 R32.1 28.52,76.2 v27.56,76.2 | U3.1 39.74,69.6 v40.13,69.6
  Top 0.61: U4.3 41.91,47.75 41.91,52.07 45.72,55.88 45.72,67.82 | SV1.1 3.05,35.56 1.65,36.96 1.65,58.42 3.29,60.06 8.91,60.06 11.3,62.45 11.3,62.94 11.35,62.98 11.35,80.96 12,81.61 22.15,81.61 v27.56,76.2
  Top 0.711: TP11.1 45.72,67.82
  Top 1.27: SV1.1 SV1.2
  Bottom 0.508: v40.13,69.6 40.13,70.61 34.54,76.2 v27.56,76.2
  pour Top (isolate 0.305): 44.45,71.12 38.61,71.12 38.61,68.07 44.45,68.07
  pour Top (isolate 0.305): 44.96,54.61 44.96,40.64 38.61,40.64 38.61,54.61
  pour Top (isolate 0.406): 43.69,40.64 44.96,40.64 44.96,45.72 43.69,45.72
+24V  (via drill 0.35)
  Top 0.305: TP20.1 11.68,5.59
  Top 0.508: TP1.1 v46.86,84.45
  Top 0.559: 11.94,9.65 11.94,5.84 11.68,5.59
  Top 0.762: v30.99,33.02 26.04,28.07 17.27,28.07
  Bottom 0.508: J1.24V(6) 33.39,89.27 34.29,90.17 44.45,90.17 46.86,87.76 v46.86,84.45 46.86,36.45 v44.32,33.91
  Bottom 1.27: SJ2.1 35.05,34.54 33.53,33.02 v30.99,33.02
  pour Top (isolate 0.406): 44.96,34.29 44.96,30.48 29.72,30.48 29.72,34.29
  pour Top (isolate 0.406): 11.68,4.83 29.21,4.83 29.21,9.91 11.68,9.91
  pour Top (isolate 0.406): 17.78,9.4 14.99,9.4 14.99,29.21 17.78,29.21
A0
  Top 0.305: SJ_A8.2 SJ_A7.2 14.22,66.17 15.48,64.92 U$1.A0
A1  (via drill 0.35)
  Top 0.305: U$1.A1 16.12,65.54 14.86,66.8 14.86,72.39 v15.62,73.15 | SJ_A11.2 15.62,77.34 | 15.62,77.34 SJ_A12.2 | v15.62,75.69 15.62,77.34
  Bottom 0.305: v15.62,75.69 v15.62,73.15
A2  (via drill 0.35)
  Top 0.305: U$1.A2 17.42,72.87 v16.51,73.79 | SJ_A9.2 16.51,80.14 | 16.51,80.14 SJ_A10.2 | 16.51,80.14 v16.51,78.23
  Bottom 0.305: v16.51,78.23 v16.51,73.79
ADDR0
  Top 0.305: SJ_A3.2 SJ_A4.2 17.02,58.93 17.78,59.69 19.3,59.69 20.57,58.42 20.57,55.92 20.13,55.47 U1.2
ADDR1  (1 unrouted)
  Top 0.305: SJ_A5.2 SJ_A6.2 | U2.2 18.72,37.69 17.17,39.24 17.17,42.9
DAC_!CLR!
  Top 0.305: R1.2 23.88,46.74 25.28,48.14 U1.9
DACB_!CLR!
  Top 0.305: TP7.1 25.21,33.15 | U2.9 TP7.1 | TP7.1 25.27,31.99 R10.2
DIM0  (via drill 0.35)
  Top 0.305: v12.06,46.99 11.56,46.48 11.56,43.94 6.98,39.37 4.45,39.37 3.81,38.73 SV1.3 | R4.1 v15.88,46.99 18.42,49.54 18.42,51.92 18.73,52.22 U1.7
  Bottom 0.305: v15.88,46.99 v12.06,46.99
DIM1  (via drill 0.35)
  Top 0.305: R18.1 v16.38,33.27 17.55,34.44 U2.7
  Bottom 0.305: v16.38,33.27 15.75,33.27 10.92,38.1 SV1.4
DIM2  (via drill 0.35)
  Top 0.305: v12.06,48.51 7.75,44.2 7.75,42.8 6.86,41.91 5.08,41.91 SV1.5 | R5.1 v15.88,48.51 17.83,50.47 17.83,52.38 18.33,52.87 U1.6
  Bottom 0.305: v15.88,48.51 v12.06,48.51
DIM3  (via drill 0.35)
  Top 0.305: R15.1 15.26,34.42 v16.26,34.42 16.93,35.09 U2.6
  Bottom 0.305: v16.26,34.42 15.49,34.42 9.27,40.64 SV1.6
DIM4  (via drill 0.35)
  Top 0.305: v12.06,50.04 10.03,48.01 10.03,47.5 6.98,44.45 4.57,44.45 3.81,43.69 SV1.7 | R7.1 v15.88,50.04 17.27,51.43 17.27,52.83 17.91,53.47 19.37,53.47 U1.5
  Bottom 0.305: v15.88,50.04 v12.06,50.04
DIM5  (via drill 0.35)
  Top 0.305: R17.1 15.38,36.83 v16.26,36.83 16.51,36.83 17.6,35.74 U2.5
  Bottom 0.305: v16.26,36.83 9.91,43.18 SV1.8
DIM6  (via drill 0.35)
  Top 0.305: R9.1 v15.88,51.56 16.66,52.35 16.66,53.24 17.6,54.17 U1.4 | v12.06,51.56 7.49,46.99 4.95,46.99 3.81,45.85 SV1.9
  Bottom 0.305: v15.88,51.56 v12.06,51.56
DIM7  (via drill 0.35)
  Top 0.305: R16.1 v16.38,37.85 17.84,36.39 U2.4
  Bottom 0.305: v16.38,37.85 8.51,45.72 SV1.10
DIM8  (via drill 0.35)
  Top 0.305: v15.88,53.21 R8.1 | U1.10 23.6,52.22 v23.49,52.32 | v12.06,53.21 11.56,53.21 7.87,49.53 5.08,49.53 SV1.11
  Bottom 0.305: v12.06,53.21 v15.88,53.21 22.61,53.21 v23.49,52.32
DIM9  (via drill 0.35)
  Top 0.305: R14.1 v16.38,39.37 | U2.10 21.82,34.44 v21.59,34.67
  Bottom 0.305: v21.59,34.67 21.08,34.67 v16.38,39.37 16.32,39.31 15.71,39.31 6.76,48.26 SV1.12
DIM10  (via drill 0.35)
  Top 0.305: SV1.13 5.08,52.07 9.27,52.07 v11.94,54.74 | v15.88,54.74 R6.1 | U1.11 24.47,52.87 24,53.34 v24,53.85
  Bottom 0.305: v11.94,54.74 v15.88,54.74 23.11,54.74 v24,53.85
DIM11  (via drill 0.35)
  Top 0.305: v16.38,41.27 15.26,41.27 R13.1 | U2.11 23.84,35.09 v22.86,36.07
  Bottom 0.305: v22.86,36.07 17.65,41.27 v16.38,41.27 12.57,45.08 12.06,45.08 11.43,45.72 11.43,46.23 6.86,50.8 SV1.14
DSCLM1  (1 unrouted)
  Top 0.305: R35.1 28.98,82.59 30.47,82.59 | 30.47,82.59 R34.2 | IC1.6 30.87,80.42 30.47,80.81 30.47,82.59 | 30.72,82.59 30.72,83.48 32.12,84.88 32.12,86.28 33.14,87.29 34.28,87.29 34.66,87.67 J1.DSCLM(5)
DSCLP1
  Top 0.305: R35.2 R33.1 29.49,79.93 29.96,79.93 30.1,79.92 IC1.7 33.51,79.92 33.77,80.18 33.77,83.74 J1.DSCLP(4)
DSDAM1  (via drill 0.35)
  Top 0.305: J1.DSDAM(2) 38.47,85.51 35.04,81.83 35.04,81.58 | R23.2 R22.1 arc-90 34.53,76.28 v34.53,77.51 | v35.8,81.58 35.04,81.58 | IC1.9 34.21,78.92 35.04,79.75 35.04,81.58
  Bottom 0.305: v35.8,81.58 35.8,78.78 v34.53,77.51
DSDAP1  (via drill 0.35)
  Top 0.305: R32.2 R23.1 31.65,77.42 v31.74,77.51 | 35.3,83.36 34.41,82.47 34.41,79.93 33.9,79.42 IC1.8 | 35.3,83.36 37.2,85.26 37.2,86.53 37.96,87.29 38.6,87.29 J1.DSDAP(1) | v34.79,83.61 35.04,83.61 35.3,83.36
  Bottom 0.305: v31.74,77.51 33.77,79.55 33.77,82.59 v34.79,83.61
GND  (via drill 0.35)
  Top 0.305: R11.1 18.43,43.16 SJ_A6.1 | SJ_A6.1 TP8.1 18.8,41.91 20.32,41.91 | SJ_A4.1 18.54,57.39 18.18,57.02 | 18.18,57.02 R2.1 | v19.05,57.02 18.18,57.02 | 23.62,54.82 U1.14 26.33,54.82 26.42,54.74 26.42,51.2 | 23.62,54.82 22.82,54.82 22.23,54.23 22.23,52.45 23.3,51.37 C2.2 23.2,49.81 23.2,48.26 | 23.2,48.26 C1.2 | 20.95,32.07 C4.2 21.37,31.53 | 21.37,31.53 22.12,30.77 C3.2 | TP9.1 20.95,31.11 21.37,31.53 | R11.1 18.41,45.1 TP3.1 18.8,45.97 19.05,45.72 | v24.38,48.39 24.26,48.26 23.2,48.26 | SJ_A10.1 19.69,78.74 | 19.69,78.74 SJ_A12.1 19.69,76.07 | 19.69,76.07 SJ_A8.1 v19.69,73.15 | R11.1 v19.43,45.08 | 23.62,54.82 v23.62,57.15 | U$1.GND 22.76,64.26 v23.62,64.26 | v32.25,81.32 32.25,82.51 R34.1 32.34,83.44 v32.76,83.86 | R22.2 36.4,77.42 v36.31,77.51 36.1,77.51 35.56,78.06 35.56,80.03 35.95,80.42 IC1.5 36.73,82.27 v36.7,82.3 | 19.69,78.74 v21.08,78.74 | v21.08,76.07 19.69,76.07 | GND.1 23.24,59.31 | GND.1 24.38,60.83 24.51,60.71 | GND.1 22.1,60.83 | 26.42,51.2 26.54,51.08 | 26.42,51.2 26.42,50.42 v26.29,50.29 | SJ_A6.1 20.19,43.05 20.32,43.18 | v27.94,36.83 27.18,36.83 26.8,37.21 26.63,37.04 U2.14 24.34,37.04 24.23,36.93 24.13,36.93 | v27.69,68.45 27.94,68.71 27.94,71.25 29.08,72.39 36.83,72.39
  Top 0.559: D2.C 15.55,26.61 v15.55,25.65
  Top 1.27: SV1.19 SV1.20
  Bottom 0.305: v19.05,57.02 21.02,58.99 | 21.02,58.99 22.86,60.83 GND.1 23.24,63.88 v23.62,64.26 | v23.62,57.15 21.78,58.99 21.02,58.99 | v24.38,48.39 22.73,48.39 v19.43,45.08
  Bottom 0.508: J1.GND(3) 37.2,86.73 37.04,86.57
  other vias: 8.89,36.83 8.89,39.37 8.51,42.29 8.64,53.34 11.43,31.75 25.4,44.45 39.12,62.23 39.12,62.99 39.88,62.23 39.88,62.99 39.12,61.47 39.88,61.47 34.29,62.99 33.53,62.99 34.29,62.23 34.29,61.47 33.53,62.23 33.53,61.47 37.08,66.8 30.99,65.53 36.07,66.8 42.93,65.53 37.59,70.1 27.56,61.85 12.32,72.52 40.64,37.34 31.5,40.13 36.58,47.24 36.58,48.01 35.81,48.01 35.81,47.24 36.58,48.77 35.81,48.77 42.93,37.34 22.61,59.31 12.19,61.47 10.54,45.59 8.89,44.07 40.64,25.15 39.37,25.15 38.1,25.15 36.83,25.15 35.56,25.15 34.29,25.15 34.29,26.42 35.56,26.42 36.83,26.42 38.1,26.42 39.37,26.42 40.64,26.42 40.64,4.83 39.37,4.83 38.1,4.83 36.83,4.83 35.56,4.83 34.29,4.83 34.29,3.56 35.56,3.56 36.83,3.56 38.1,3.56 39.37,3.56 40.64,3.56 13.26,17.78 13.51,28.96 26.29,30.73 28.96,28.32 33.02,91.44 44.45,87.63 45.72,91.44 45.47,37.34 46.36,33.91 33.02,55.88 41.91,57.15 45.85,54.1 6.35,21.59 8.89,3.81 27.94,2.54 44.45,22.86 11.43,96.52 15.24,83.82 42.8,73.03 2.54,33.02 10.41,63.37 45.72,69.72 12.45,45.97 10.8,40.89
  pour Bottom: 10.16,97.79 10.16,60.32 1.27,60.32 1.27,27.94 63.5,27.94 63.5,97.79
  pour Top (isolate 0.406, rank 3): 45.72,59.18 45.72,71.88 27.94,71.88 27.94,59.18
  pour Bottom (isolate 0.406): 45.97,59.18 27.94,59.18 27.94,71.88 45.97,71.88
  pour Top (isolate 0.305, rank 2): 44.96,59.69 44.96,30.48 28.7,30.48 28.7,59.69
  pour Bottom (isolate 0.406, rank 2): 28.96,55.88 28.96,30.48 44.96,30.48 44.96,55.88
  pour Top (isolate 0.305, rank 2): 11.43,29.72 46.99,29.72 46.99,0.51 11.43,0.51
  pour Bottom (isolate 0.406, rank 2): 46.99,29.72 46.99,0.51 1.52,0.51 1.52,29.72
  pour Top: 2.03,30.48 2.03,0.89 11.56,0.89 11.56,4.06 10.8,4.06 10.8,10.67 10.67,10.79 11.43,10.79 11.43,27.18 13.97,29.72 14.99,30.73 14.99,31.11 2.54,31.11 2.03,30.61
  pour Top: 18.54,29.59 18.54,30.61 29.08,30.61 29.08,29.21 18.92,29.21
  pour Top: 47.24,29.08 47.24,97.54 10.41,97.54 10.41,82.55 45.59,82.55 45.59,39.37 43.18,39.37 43.18,35.05 45.59,35.05 45.59,29.08
  pour Top: 36.45,82.42 36.7,82.17 36.7,81.03 43.05,81.03 44.7,79.38 44.7,75.82 41.66,72.77 36.7,72.77 35.69,71.76 37.95,71.76 38.2,72.01 45.08,72.01 45.08,69.6 45.72,68.96 46.86,68.96 46.86,82.55 45.72,83.69 37.72,83.69
  pour Top: 2.03,29.34 2.03,58.67 3.43,60.07 8.25,60.07 10.16,61.98 10.16,97.54 26.29,97.54 26.42,97.41 26.42,90.3 26.16,90.04 26.16,85.22 27.81,83.57 27.81,40.64 28.96,39.5 28.96,32.13 26.04,29.21 18.67,29.21 18.03,29.84 4.06,29.84 3.56,29.34
N$1
  Top 0.305: D1.A 33.29,64.8 39.27,64.8 41.35,62.72 R24.1
N$2
  Top 0.559: D2.A 13.95,26.64 R27.1
N$3
  Top 0.559: R25.1 40.88,38.89 D3.A
SC0  (via drill 0.35)
  Top 0.305: U$1.SC0 18.08,63.71 18.54,63.25 24.26,63.25 28.32,59.18 v28.32,56.64 28.32,56.39 | U1.16 25.9,56.12 v26.42,56.64 | 28.32,56.39 TP5.1 v28.32,41.15 | U2.16 25.91,38.34 26.29,38.72 v26.29,39.12 | R20.1 28.34,56.37 28.32,56.39
  Bottom 0.305: v28.32,56.64 v26.42,56.64 | v26.29,39.12 v28.32,41.15
SCL
  Top 0.305: U$1.SCL 16.77,69.59 17.4,68.96 23.24,68.96 28.07,73.79 34.67,73.79 35.24,74.36 40.07,74.36 42.88,77.17 R37.1 42.88,78.82 41.26,80.43 38.47,80.43 37.95,79.92 IC1.4
SD0
  Top 0.305: U$1.SD0 17.42,63.22 18.41,62.23 23.88,62.23 27.3,58.8 27.3,57.91 | 27.3,57.91 27.3,55.47 | U1.15 27.3,55.47 | U2.15 26.39,37.69 27.3,38.61 TP4.1 27.33,47.77 27.3,47.8 27.3,55.47 | R21.1 27.25,57.96 27.3,57.91
SDA  (via drill 0.35)
  Top 0.305: U$1.SDA 16.12,68.97 17.27,67.82 23.62,67.82 28.75,72.95 35.56,72.95 36.08,73.46 40.84,73.46 43.88,76.51 43.88,78.96 v43.3,79.55 | IC1.2 37.97,78.92 38.56,79.51 R36.1 40.84,79.51 v40.88,79.55
  Bottom 0.305: v43.3,79.55 v40.88,79.55

### Text on the board
tPlace: Relay / Board / Adapter | +24V | ADDRESS | A2 | A1 | A0 | 3.3V | GND | 5V | GND | 3.3V | Multiplex / Reset | GND | 5-to-3V3@400mA Lin Reg | 5V | SDA | SCL | GND | +3V3 | GND | GND | 24V | Barrel Jack Connector w/24V Conditioning + Fuse + LED | 24V | GND | EDGE | 24V | GND